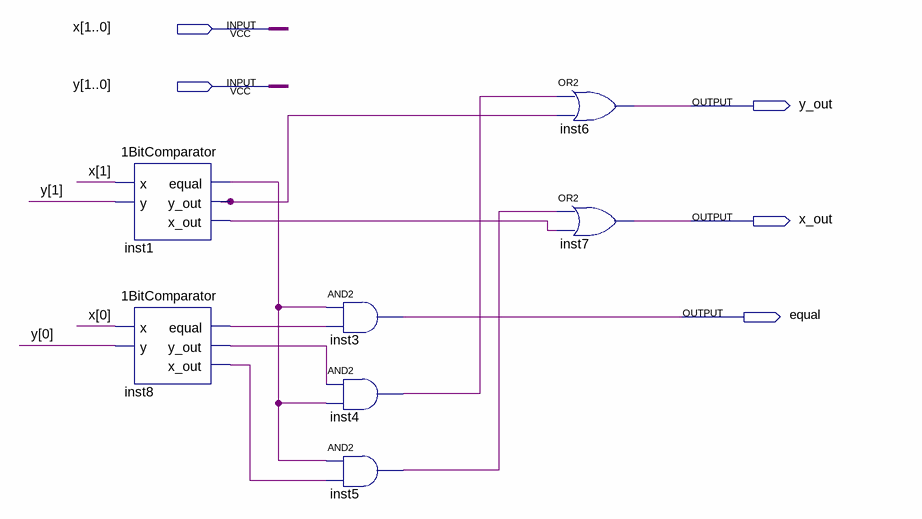
[diagram p0: schematic sheet]
// Quartus schematic 2BitComparator.bdf as structural Verilog: 7 symbols, 5 pins
module \2BitComparator  (
  input  [1:0] x,
  input  [1:0] y,
  output y_out,
  output x_out,
  output equal
);

  wire inst1_equal, inst1_x_out, inst1_y_out, inst4_out, inst5_out, inst8_equal, inst8_x_out, inst8_y_out;

  \1BitComparator  inst1 (.x(x[1]), .y(y[1]), .equal(inst1_equal), .y_out(inst1_y_out), .x_out(inst1_x_out));
  \1BitComparator  inst8 (.x(x[0]), .y(y[0]), .equal(inst8_equal), .y_out(inst8_y_out), .x_out(inst8_x_out));
  and inst3 (equal, inst1_equal, inst8_equal);
  and inst4 (inst4_out, inst8_y_out, inst1_equal);
  and inst5 (inst5_out, inst1_equal, inst8_x_out);
  or inst6 (y_out, inst4_out, inst1_y_out);
  or inst7 (x_out, inst5_out, inst1_x_out);
endmodule
